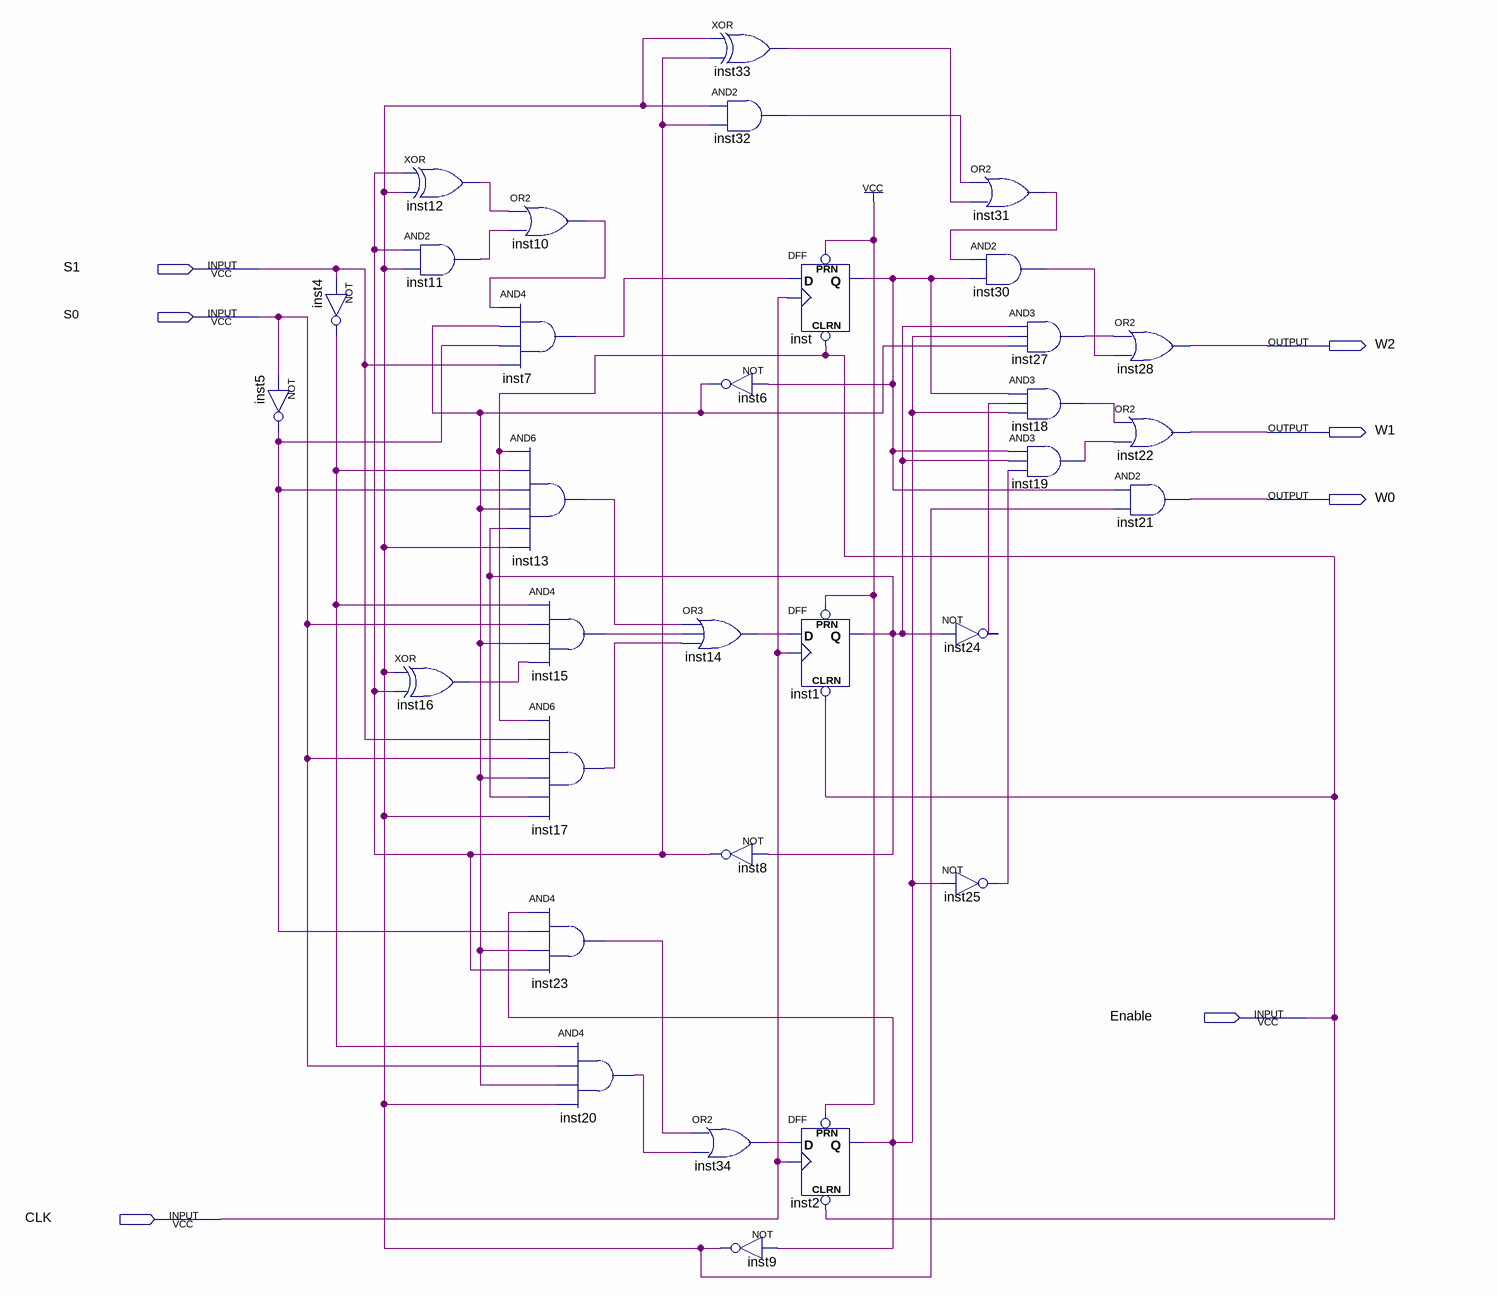
[diagram p0: schematic sheet]
// Quartus schematic sevenfiveFSM.bdf as structural Verilog: 32 symbols, 7 pins
module sevenfiveFSM (
  input  S1,
  input  S0,
  input  Enable,
  input  CLK,
  output W2,
  output W1,
  output W0
);

  wire inst1_q, inst2_q, inst4_out, inst5_out, inst6_out, inst7_out, inst8_out, inst9_out, inst10_out,
       inst11_out, inst12_out, inst13_out, inst14_out, inst15_out, inst16_out, inst17_out, inst18_out,
       inst19_out, inst20_out, inst23_out, inst24_out, inst25_out, inst27_out, inst30_out, inst31_out,
       inst32_out, inst33_out, inst34_out, inst_q;

  not inst4 (inst4_out, S1);
  not inst5 (inst5_out, S0);
  xor inst16 (inst16_out, inst9_out, inst8_out);
  xor inst12 (inst12_out, inst8_out, inst9_out);
  and inst11 (inst11_out, inst8_out, inst9_out);
  or inst10 (inst10_out, inst12_out, inst11_out);
  and inst7 (inst7_out, inst10_out, inst6_out, inst5_out, S1);
  and inst13 (inst13_out, Enable, inst4_out, inst5_out, inst6_out, inst1_q, inst9_out);
  and inst15 (inst15_out, inst4_out, S0, inst6_out, inst16_out);
  and inst17 (inst17_out, Enable, S1, S0, inst6_out, inst1_q, inst9_out);
  and inst23 (inst23_out, inst2_q, inst5_out, inst6_out, inst8_out);
  and inst20 (inst20_out, inst4_out, S0, inst6_out, inst9_out);
  or inst14 (inst14_out, inst13_out, inst15_out, inst17_out);
  or inst34 (inst34_out, inst23_out, inst20_out);
  xor inst33 (inst33_out, inst9_out, inst8_out);
  and inst32 (inst32_out, inst9_out, inst8_out);
  not inst6 (inst6_out, inst_q);
  not inst8 (inst8_out, inst1_q);
  not inst9 (inst9_out, inst2_q);
  DFF inst (.CLRN(Enable), .CLK(CLK), .D(inst7_out), .PRN(1'b1), .Q(inst_q));
  DFF inst1 (.CLRN(Enable), .CLK(CLK), .D(inst14_out), .PRN(1'b1), .Q(inst1_q));
  DFF inst2 (.CLRN(Enable), .CLK(CLK), .D(inst34_out), .PRN(1'b1), .Q(inst2_q));
  or inst31 (inst31_out, inst32_out, inst33_out);
  and inst30 (inst30_out, inst31_out, inst_q);
  and inst27 (inst27_out, inst1_q, inst2_q, inst6_out);
  and inst18 (inst18_out, inst_q, inst24_out, inst2_q);
  and inst19 (inst19_out, inst_q, inst1_q, inst25_out);
  not inst24 (inst24_out, inst1_q);
  not inst25 (inst25_out, inst2_q);
  or inst28 (W2, inst27_out, inst30_out);
  or inst22 (W1, inst18_out, inst19_out);
  and inst21 (W0, inst_q, inst9_out);
endmodule
